# Altium schematic sheet Isolation.SchDoc
size 406 x 304 mm; SheetNumber: 10; SheetTotal: 22
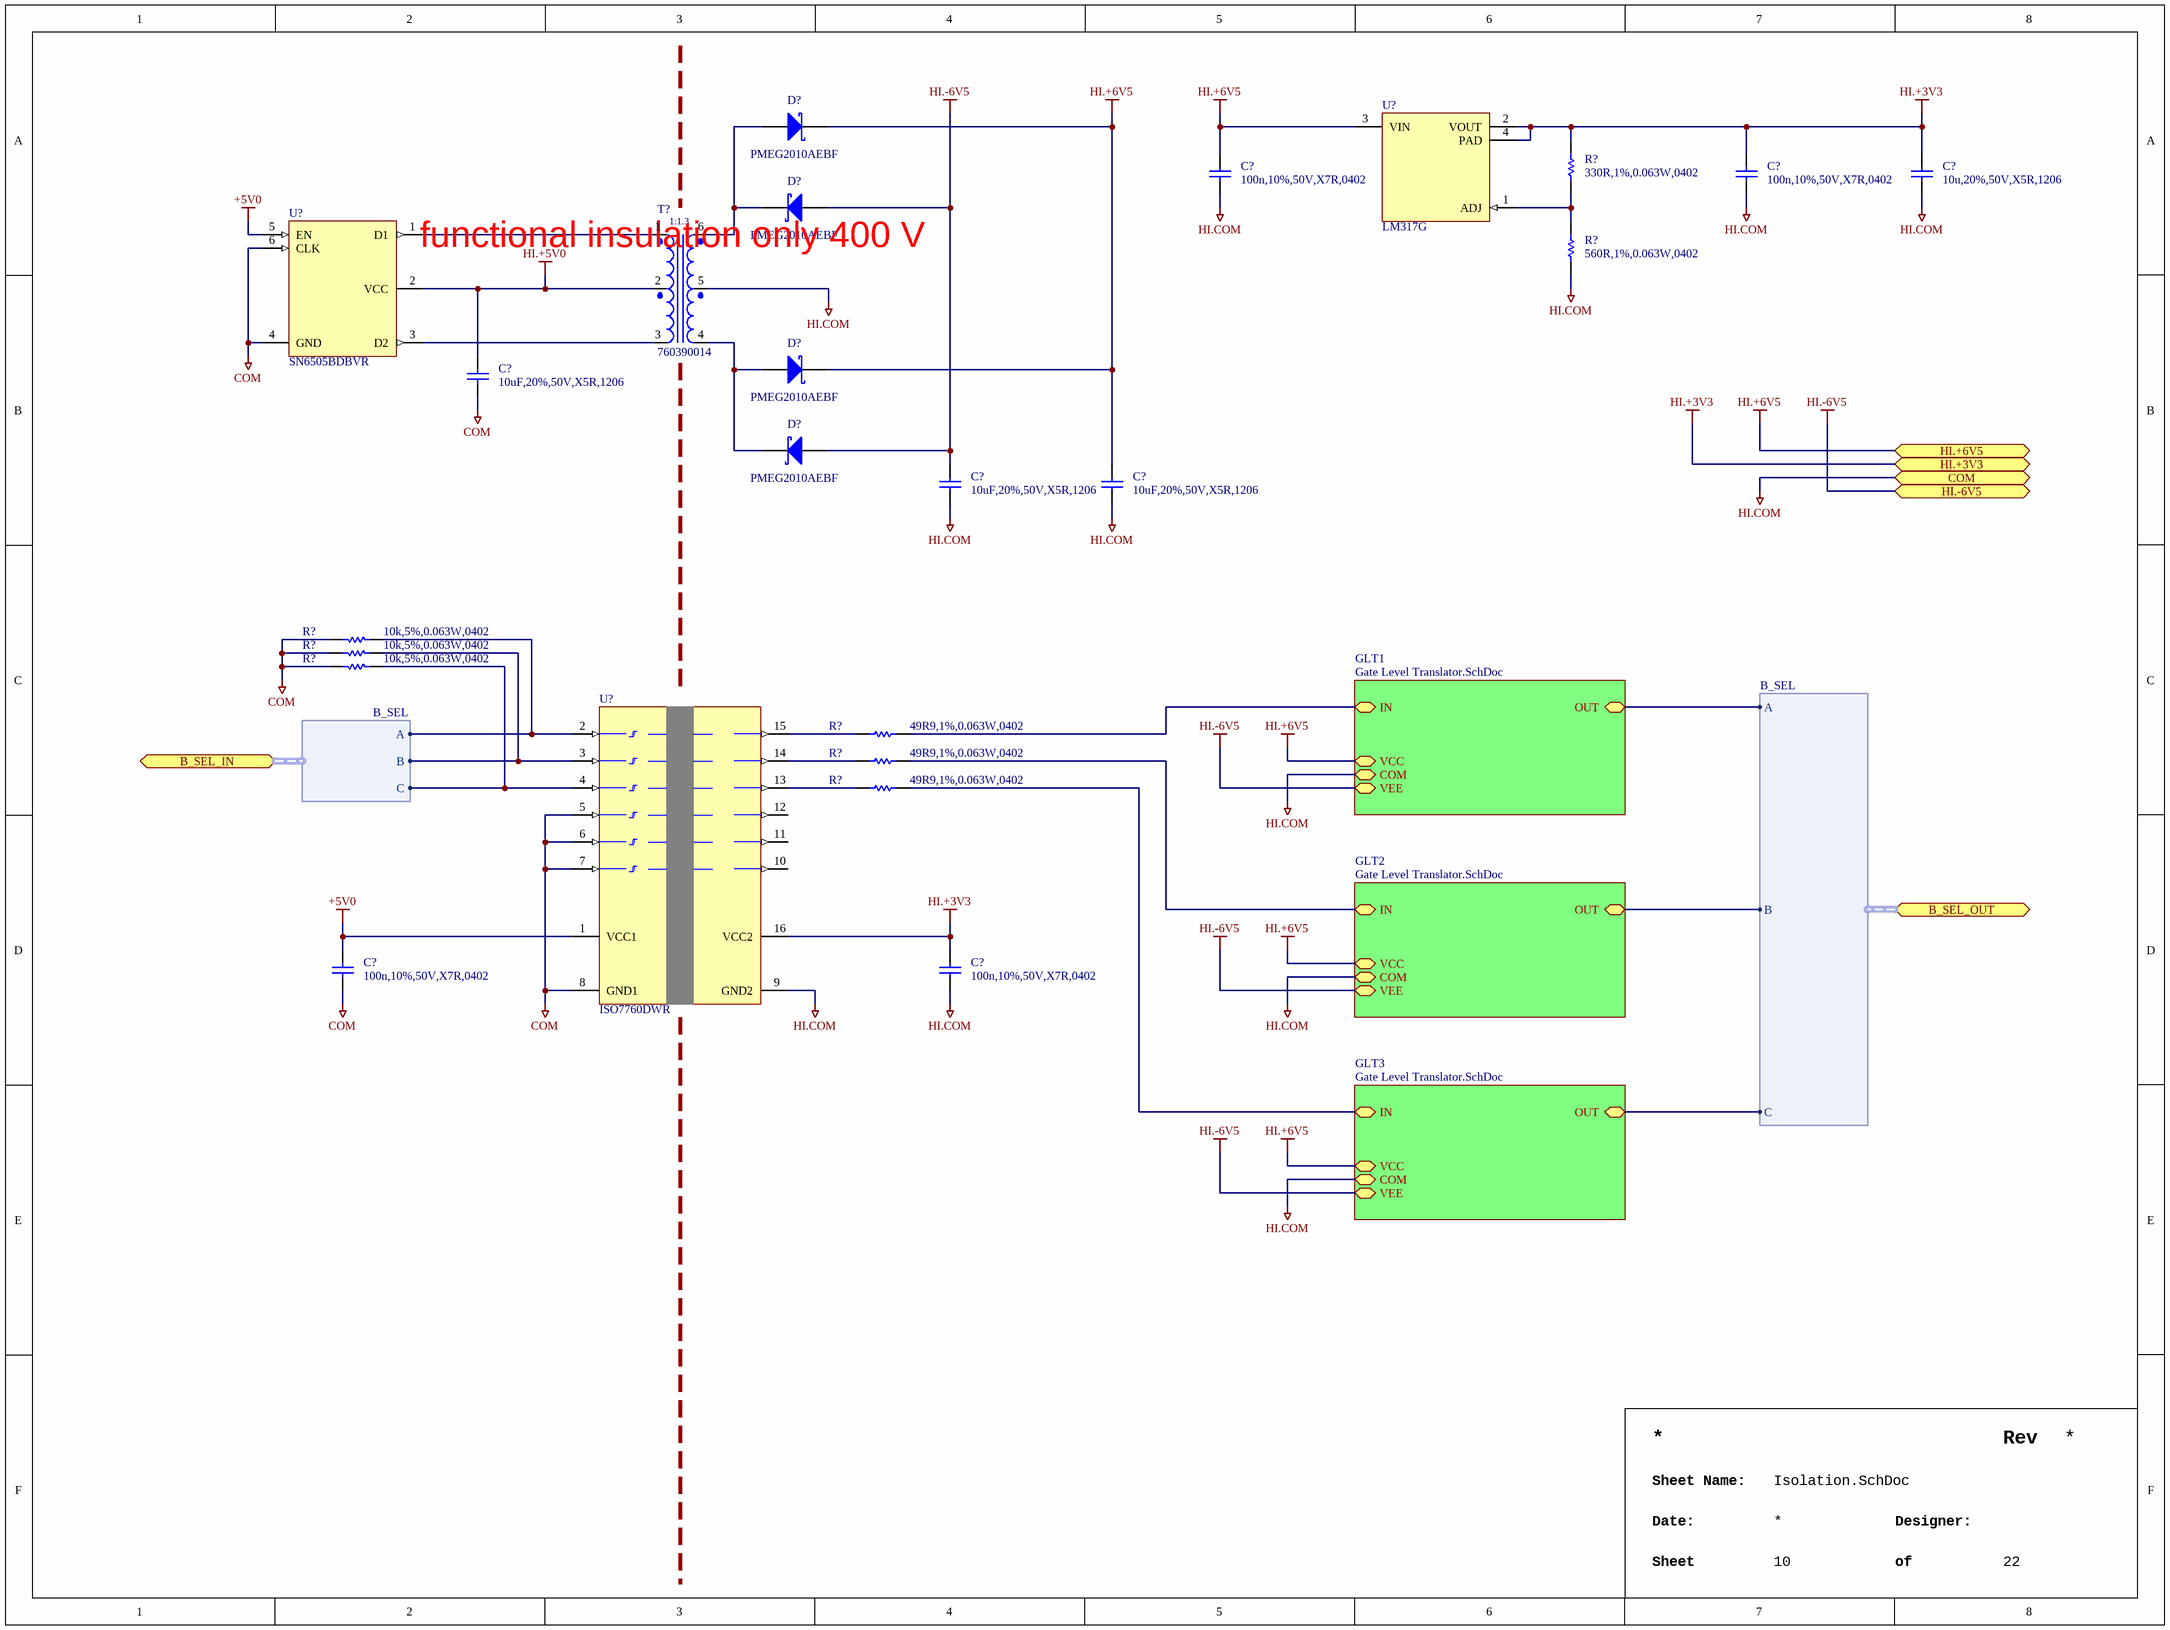
[diagram p0: Isolation.SchDoc]

## Parts
(Parts that share a designator on the sheet are numbered #1, #2 ... from top to bottom, then left to right.)
C?#1  100n,10%,50V,X7R,0402  [CAPC1005X06N]
C?#2  100n,10%,50V,X7R,0402  [CAPC1005X06N]
C?#3  10u,20%,50V,X5R,1206  [CAPC3216X16N]
C?#4  10uF,20%,50V,X5R,1206  [CAPC3216X16N]
C?#5  10uF,20%,50V,X5R,1206  [CAPC3216X16N]
C?#6  10uF,20%,50V,X5R,1206  [CAPC3216X16N]
C?#7  100n,10%,50V,X7R,0402  [CAPC1005X06N]
C?#8  100n,10%,50V,X7R,0402  [CAPC1005X06N]
D?#1  PMEG2010AEBF  [NEXPERIA_PKG_SOD523]
D?#2  PMEG2010AEBF  [NEXPERIA_PKG_SOD523]
D?#3  PMEG2010AEBF  [NEXPERIA_PKG_SOD523]
D?#4  PMEG2010AEBF  [NEXPERIA_PKG_SOD523]
R?#1  330R,1%,0.063W,0402  [RESC1005X04N]
R?#2  560R,1%,0.063W,0402  [RESC1005X04N]
R?#3  10k,5%,0.063W,0402  [RESC1005X04N]
R?#4  10k,5%,0.063W,0402  [RESC1005X04N]
R?#5  10k,5%,0.063W,0402  [RESC1005X04N]
R?#6  49R9,1%,0.063W,0402  [RESC1005X04N]
R?#7  49R9,1%,0.063W,0402  [RESC1005X04N]
R?#8  49R9,1%,0.063W,0402  [RESC1005X04N]
T?  760390014  [WURTH_760390014]
U?#1  LM317G  [UMW_PKG_SOT223-3L]
U?#2  SN6505BDBVR  [TEXASINSTRUMENTS_PKG_]
U?#3  ISO7760DWR  [TEXASINSTRUMENTS_PKG_DW0016B]

## Sub-sheets
GLT1 = Gate Level Translator.SchDoc: VCC (bidir), COM (bidir), VEE (bidir), IN (bidir), OUT (bidir)
GLT2 = Gate Level Translator.SchDoc: VCC (bidir), COM (bidir), VEE (bidir), IN (bidir), OUT (bidir)
GLT3 = Gate Level Translator.SchDoc: VCC (bidir), COM (bidir), VEE (bidir), IN (bidir), OUT (bidir)

## Ports
B_SEL_IN (bidir, harness B_SEL), B_SEL_OUT (bidir, harness B_SEL), COM (bidir), HI.+3V3 (bidir), HI.+6V5 (bidir), HI.-6V5 (bidir)

## Harnesses
B_SEL: C, B, A

## Nets
+5V0: C?#7.2 U?#2.5(EN) U?#3.1(VCC1)
COM: C?#4.1 C?#7.1 R?#3.1 R?#4.1 R?#5.1 U?#2.4(GND) U?#2.6(CLK) U?#3.5(IND) U?#3.6(INE) U?#3.7(INF) U?#3.8(GND1)
HI.+3V3: C?#2.2 C?#3.2 C?#8.2 R?#1.2 U?#1.2(VOUT) U?#1.4(PAD) U?#3.16(VCC2) ; port HI.+3V3
HI.+5V0: C?#4.2 T?.2(PCT) U?#2.2(VCC)
HI.+6V5: C?#1.2 C?#6.2 D?#1.1(K) D?#3.1(K) U?#1.3(VIN) ; port HI.+6V5, sheet GLT1/VCC, sheet GLT2/VCC, sheet GLT3/VCC
HI.-6V5: C?#5.2 D?#2.2(A) D?#4.2(A) ; port HI.-6V5, sheet GLT1/VEE, sheet GLT2/VEE, sheet GLT3/VEE
HI.COM: C?#1.1 C?#2.1 C?#3.1 C?#5.1 C?#6.1 C?#8.1 R?#2.1 T?.5(SCT) U?#3.9(GND2) ; port COM, sheet GLT1/COM, sheet GLT2/COM, sheet GLT3/COM
NetD?#1_2: D?#1.2(A) D?#2.1(K) T?.6(S+)
NetD?#3_2: D?#3.2(A) D?#4.1(K) T?.4(S-)
NetR?#1_1: R?#1.1 R?#2.2 U?#1.1(ADJ)
NetR?#3_2: R?#3.2 U?#3.2(INA) ; port B_SEL_IN.A
NetR?#4_2: R?#4.2 U?#3.3(INB) ; port B_SEL_IN.B
NetR?#5_2: R?#5.2 U?#3.4(INC) ; port B_SEL_IN.C
NetR?#6_1: R?#6.1 U?#3.15(OUTA)
NetR?#6_2: R?#6.2 ; sheet GLT1/IN
NetR?#7_1: R?#7.1 U?#3.14(OUTB)
NetR?#7_2: R?#7.2 ; sheet GLT2/IN
NetR?#8_1: R?#8.1 U?#3.13(OUTC)
NetR?#8_2: R?#8.2 ; sheet GLT3/IN
NetT?_1: T?.1(P+) U?#2.1(D1)
NetT?_3: T?.3(P-) U?#2.3(D2)
(unnamed): sheet GLT1/OUT, port B_SEL_OUT.A
(unnamed): sheet GLT2/OUT, port B_SEL_OUT.B
(unnamed): sheet GLT3/OUT, port B_SEL_OUT.C

Not connected (* = marked no-connect by the designer): U?#3 10(OUTF) 11(OUTE) 12(OUTD)

## Notes on the sheet
- functional insulation only 400 V
- Rev
- Sheet Name:
- Date:
- Sheet
- Designer:
- of
- (in symbol XFR,1-1.3,Lp=475uH,760390014) 1:1.3

## Library data of the parts
C?#1 C?#2 C?#7 C?#8 = CAP,Cer,100nF,10%,50V,X7R,0402: 50V 100nF X7R Â±10% 0402 Ceramic Capacitors ROHS; Manufacturer 1: Murata; Manufacturer 1 Part Number: GRM155R71H104KE14D; Vendor 1 Part Number: C77020; Vendor 1: LCSC; Part Name: CAP,Cer,100nF,10%,50V,X7R,0402; CreatedBy: Judd Foster; HelpURL: https://www.lcsc.com/datasheet/C77020.pdf; Value: 100n
C?#3 = CAP,Cer,10uF,50VDC,X5R,1206: 10ï¿½F ï¿½20% 50V Ceramic Capacitor X5R 1206 (3216 Metric); Manufacturer 1: Samsung Electro-Mechanics; Manufacturer 1 Part Number: CL31A106MBHNNNE; Vendor 1 Part Number: 1276-6736-1-ND; Vendor 1: Digikey; Part Name: CAP,Cer,10uF,50VDC,X5R,1206; CreatedBy: Judd Foster; HelpURL: https://www.samsungsem.com/resources/file/global/support/product_catalog/MLCC.pdf; Value: 10u
C?#4-C?#6 = CAP,Cer,10uF,50VDC,X5R,1206: 10ï¿½F ï¿½20% 50V Ceramic Capacitor X5R 1206 (3216 Metric); Manufacturer 1: Samsung Electro-Mechanics; Manufacturer 1 Part Number: CL31A106MBHNNNE; Vendor 1 Part Number: 1276-6736-1-ND; Vendor 1: Digikey; Value: 10u; Part Name: CAP,Cer,10uF,50VDC,X5R,1206; CreatedBy: Judd Foster; HelpURL: https://www.samsungsem.com/resources/file/global/support/product_catalog/MLCC.pdf
D?#1-D?#4 = DIODE,Schottky,20V,1A,SOD523: Diode 20 V 1A Surface Mount SOD-523; Manufacturer 1: Nexperia USA Inc.; Vendor 1 Part Number: 1727-8539-1-ND; Vendor 1: DigiKey; Part Name: DIODE,Schottky,20V,1A,SOD523; CreatedBy: Judd Foster; HelpURL: https://assets.nexperia.com/documents/data-sheet/PMEG2010AEB.pdf; Manufacturer 1 Part Number: PMEG2010AEBF
R?#1 = RES,330R,1%,0.063W,0402: 330 Ohms Â±1% 0.063W, 1/16W Chip Resistor 0402 (1005 Metric) Moisture Resistant Thick Film; Manufacturer 1: YAGEO; Manufacturer 1 Part Number: RC0402FR-07330RL; Vendor 1 Part Number: 311-330LRCT-ND; Vendor 1: DigiKey; Value: 330; Part Name: RES,330R,1%,0.063W,0402; CreatedBy: Judd Foster; HelpURL: https://www.yageo.com/upload/media/product/products/datasheet/rchip/PYu-RC_Group_51_RoHS_L_12.pdf
R?#2 = RES,560R,1%,0.063W,0402: 562 Ohms Â±1% 0.063W, 1/16W Chip Resistor 0402 (1005 Metric) Moisture Resistant Thick Film; Manufacturer 1: YAGEO; Manufacturer 1 Part Number: RC0402FR-07562RL; Vendor 1 Part Number: YAG3186CT-ND; Vendor 1: DigiKey; Part Name: RES,560R,1%,0.063W,0402; CreatedBy: Judd Foster; HelpURL: https://www.yageo.com/upload/media/product/products/datasheet/rchip/PYu-RC_Group_51_RoHS_L_12.pdf
R?#3-R?#5 = RES,10k,5%,0.063W,0402: 10 kOhms ï¿½5% 0.063W, 1/16W Chip Resistor 0402 (1005 Metric) Automotive AEC-Q200 Thick Film; Manufacturer 1: Stackpole Electronics Inc; Manufacturer 1 Part Number: RMCF0402JT10K0; Vendor 1 Part Number: RMCF0402JT10K0CT-ND; Vendor 1: DIgikey; Part Name: RES,10k,5%,0.063W,0402; CreatedBy: Judd Foster; HelpURL: https://www.seielect.com/catalog/sei-rmcf_rmcp.pdf; Value: 10k
R?#6-R?#8 = RES,49R9,1%,0.063W,0402: 49.9 Ohms Â±1% 0.063W, 1/16W Chip Resistor 0402 (1005 Metric) Moisture Resistant Thick Film; Manufacturer 1: YAGEO; Manufacturer 1 Part Number: RC0402FR-0749R9L; Vendor 1 Part Number: 311-49.9LRCT-ND; Vendor 1: DigiKey; Value: 49.9; Part Name: RES,49R9,1%,0.063W,0402; CreatedBy: Judd Foster; HelpURL: https://www.yageo.com/upload/media/product/products/datasheet/rchip/PYu-RC_Group_51_RoHS_L_12.pdf
T? = XFR,1-1.3,Lp=475uH,760390014: Forward, Push-Pull Converters For For DC/DC Converters SMPS Transformer 2500VAC Isolation 10kHz Surface Mount; Manufacturer 1: WÃ¼rth Elektronik; Vendor 1 Part Number: 732-4458-1-ND; Vendor 1: DigiKey; Part Name: XFR,1-1.3,Lp=475uH,760390014; CreatedBy: Judd Foster; HelpURL: https://www.we-online.com/components/products/datasheet/760390014.pdf; Manufacturer 1 Part Number: 760390014
U?#1 = LM317G: 75dB@(120Hz) 2.2A Adjustable 1.2V~37V Positive electrode 40V SOT-223 Voltage Regulators - Linear, Low Drop Out (LDO) Regulators ROHS; Manufacturer 1: UMW(Youtai Semiconductor Co., Ltd.); Vendor 1 Part Number: C347367; Vendor 1: LCSC; Part Name: LM317G; CreatedBy: Judd Foster; HelpURL: https://www.lcsc.com/datasheet/lcsc_datasheet_2411131159_UMW-Youtai-Semiconductor-Co---Ltd--LM317G_C347367.pdf; Manufacturer 1 Part Number: LM317G
U?#2 = SN6505BDBVR: Transformer Driver PMIC SOT-23-6; Manufacturer 1: Texas Instruments; Vendor 1 Part Number: 296-47311-1-ND; Vendor 1: DigiKey; Part Name: SN6505BDBVR; CreatedBy: Judd Foster; HelpURL: https://www.ti.com/general/docs/suppproductinfo.tsp?distId=10&gotoUrl=https%3A%2F%2Fwww.ti.com%2Flit%2Fgpn%2Fsn6505a; Manufacturer 1 Part Number: SN6505BDBVR
U?#3 = ISO7760DWR: General Purpose Digital Isolator 5000Vrms 6 Channel 100Mbps 85kV/Âµs CMTI 16-SOIC (0.295", 7.50mm Width); Manufacturer 1: Texas Instruments; Vendor 1 Part Number: 296-48142-1-ND; Vendor 1: DigiKey; Part Name: ISO7760DWR; CreatedBy: Judd Foster; HelpURL: https://www.ti.com/lit/ds/symlink/iso7760.pdf?ts=1712058534565&ref_url=https%253A%252F%252Fwww.ti.com%252Fsitesearch%252Fen-us%252Fdocs%252Funiversalsearch.tsp%253FlangPref%253Den-US%2526searchTerm%253DISO7760DBQR%2526nr%253D9; Manufacturer 1 Part Number: ISO7760DWR